# EAGLE design d_enc_v2 (EAGLE 7.2.0)
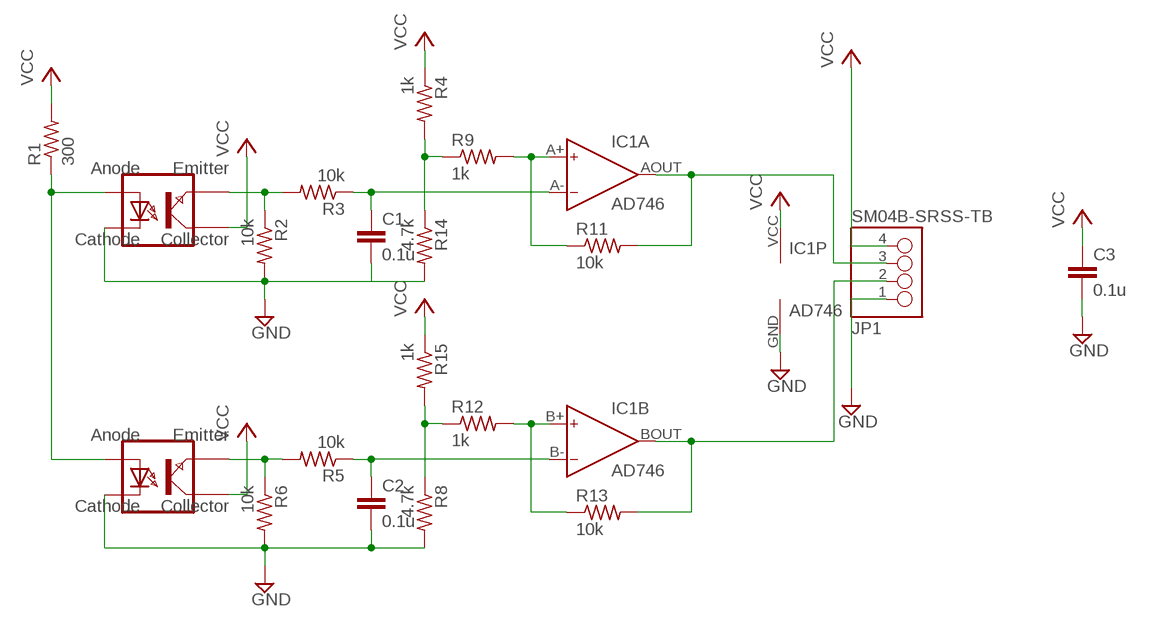
[diagram p0: schematic, sheet 1]

## Parts
C1  0.1u  C-EUC0603  [C0603]
C2  0.1u  C-EUC0603  [C0603]
C3  0.1u  C-EUC0603  [C0603]
IC1  AD746  [NJM2903E]
JP1  SM04B-SRSS-TB  [SM04B-SRSS-TB]
R1  300  R-US_R0603  [R0603]
R2  10k  R-US_R0603  [R0603]
R3  10k  R-US_R0603  [R0603]
R4  1k  R-US_R0603  [R0603]
R5  10k  R-US_R0603  [R0603]
R6  10k  R-US_R0603  [R0603]
R8  4.7k  R-US_R0603  [R0603]
R9  1k  R-US_R0603  [R0603]
R11  10k  R-US_R0603  [R0603]
R12  1k  R-US_R0603  [R0603]
R13  10k  R-US_R0603  [R0603]
R14  4.7k  R-US_R0603  [R0603]
R15  1k  R-US_R0603  [R0603]
U$1  TPR-105F  [TPR-105F]
U$4  TPR-105F  [TPR-105F]

## Nets
GND: C1.2 C2.2 C3.2 IC1.GND(P:V-) JP1.1 R2.2 R6.2 R8.2 R14.2 U$1.CATHODE U$4.CATHODE
N$1: C1.1 IC1.A-(A:IN-) R3.1
N$2: R1.1 U$1.ANODE U$4.ANODE
N$3: R2.1 R3.2 U$4.EMITTER
N$4: R5.2 R6.1 U$1.EMITTER
N$5: IC1.A+(A:IN+) R9.2 R11.1
N$6: C2.1 IC1.B-(B:IN-) R5.1
N$7: IC1.AOUT(A:OUT) JP1.3 R11.2
N$8: IC1.BOUT(B:OUT) JP1.2 R13.2
N$12: R8.1 R12.1 R15.2
N$13: IC1.B+(B:IN+) R12.2 R13.1
N$14: R4.2 R9.1 R14.1
VCC: C3.1 IC1.VCC(P:V+) JP1.4 R1.2 R4.1 R15.1 U$1.COLLECTOR U$4.COLLECTOR

## Library data of the parts
C1-C3 = rcl:C-EU: CAPACITOR, European symbol
IC1 = analog-devices:AD746: Dual Precision, 500 ns Settling, BiFET Op Amp Source: http://www.analog.com/static/imported-files/data_sheets/AD746.pdf
JP1 = con-jst-sh:SM04B-SRSS-TB
R1-R6 R8 R9 R11-R15 = rcl:R-US_: RESISTOR, American symbol
U$1 U$4 = lbr-127hld:TPR-105F

## Board
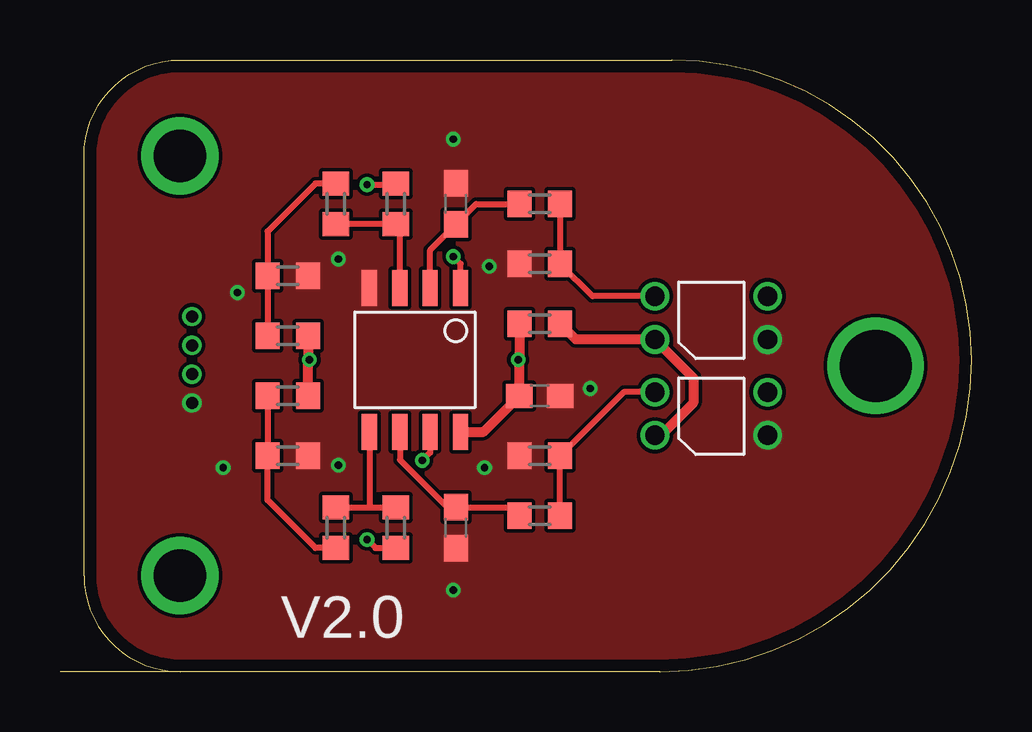
[diagram p1: board, top side]
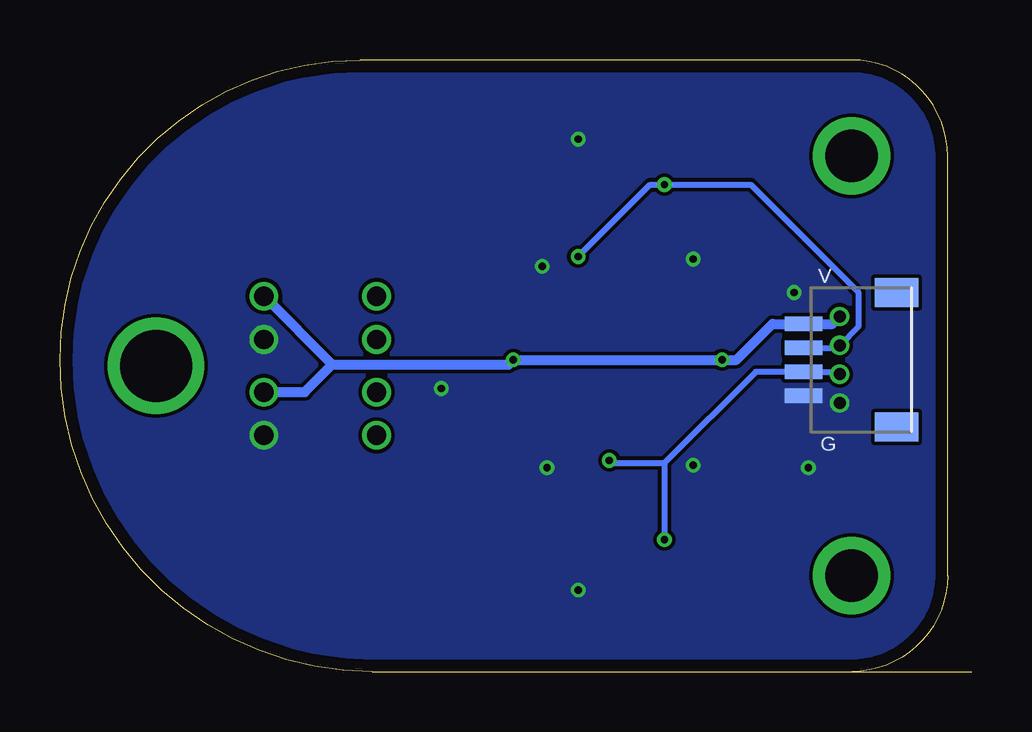
[diagram p2: board, bottom side, seen from below]

Size 38 x 25.5 mm. Coordinates in mm from the lower left corner, seen from the top.
Outline: 5,0 25,0 arc90 38,13 arc90 25.5,25.5 5,25.5 arc90 1,21.5 1,4 arc90 5,0
Outline: 5,0 0,0
Copper layers (1*16): Top 0.035mm / dielectric 1.6mm / Bottom 0.035mm
Design rules "Elecrow_2-layer_PCB_eagle_rule": minimum track width 6mil, minimum drill 12mil, track to track 6mil, track to pad 6mil, pad to pad 6mil, via to via 8mil, smd to smd 0mil, copper to edge 20mil, drill to drill 10mil, minimum pad ring 6mil, minimum via ring 6mil, stop-mask expansion 0mil, vias tented up to drill 100mil, thermal gap 10mil

### Footprints (pad centres in the part's own frame; a part is rotated, then mirrored left to right if it is on the bottom)
C0603 = smd 1.1 x 1: 1 -0.85,0; 2 0.85,0
NJM2903E = smd 1.5 x 0.635: A+ -3,-0.63; A- -3,0.63; AOUT -3,1.9; B+ 3,-1.9; B- 3,-0.63; BOUT 3,0.63; GND -3,-1.9; VCC 3,1.9
SM04B-SRSS-TB = smd 0.6 x 1.55: 1 -1.5,0; 2 -0.5,0; 3 0.5,0; 4 1.5,0 | smd 1.2 x 1.8: P-MOUNT1 -2.8,-3.875; P-MOUNT2 2.8,-3.875
R0603 = smd 1 x 1.1: 1 -0.85,0; 2 0.85,0
TPR-105F = drill 0.8: ANODE 3.7,2.4; CATHODE -1,2.4; COLLECTOR -1,0.6; EMITTER 3.7,0.6

### Placement (x,y rotation side)
C1  16.5,19.5 90 top
C2  16.5,6 270 top
C3  20,11.5 0 top
IC1  14.8,13 270 top
JP1  7,13 90 bottom
R1  20,14.5 180 top
R2  20,17 180 top
R3  20,19.5 0 top
R4  9.5,14 180 top
R5  20,6.5 0 top
R6  20,9 180 top
R8  9.5,9 0 top
R9  11.5,19.5 270 top
R11  14,19.5 90 top
R12  11.5,6 90 top
R13  14,6 270 top
R14  9.5,16.5 0 top
R15  9.5,11.5 180 top
U$1  28.5,12.25 180 top
U$4  28.5,16.25 180 top

### Tracks (layer width: path | path; a pad name or v marks a point on that pad's centre or on a via)
GND  (via drill 0.3, 0.5)
  other vias: 6.8,8.5 16.4,3.4 16.4,22.2 11.6,17.2 11.6,8.6 7.4,15.8 17.9,16.9 22.1,11.8 17.7,8.5 5.5,11.2
  pour Top (rank 6, no thermals): -19,40 51,40 51,-5 -19,-5
  pour Bottom (rank 6, no thermals): -14,35 46,35 46,-2 -14,-2
N$1
  Top 0.254: IC1.A- 15.43,17.58 C1.1 17.35,19.5 R3.1
N$2
  Top 0.406: U$1.ANODE 25.05,9.85 26.4,11.2 26.4,12.25 U$4.ANODE 21.5,13.85 R1.1
N$3
  Top 0.254: U$4.EMITTER 22.2,15.65 R2.1 R3.2
N$4
  Top 0.254: R5.2 R6.1 23.5,11.65 U$1.EMITTER
N$5
  Top 0.254: IC1.A+ 14.17,18.48 R11.1 R9.2
N$6
  Top 0.254: R5.1 18.8,6.85 C2.1 16.15,6.85 14.17,8.83 IC1.B-
N$7  (via drill 0.3, 0.5)
  Top 0.254: IC1.AOUT 16.7,17 v16.4,17.3 | v12.8,20.3 13.95,20.3 R11.2
  Bottom 0.254: v16.4,17.3 13.4,20.3 v12.8,20.3 9.2,20.3 4.7,15.8 4.7,14.4 v5.5,13.6 5.6,13.5 JP1.3
N$8  (via drill 0.3, 0.5)
  Top 0.254: v12.8,5.5 13.15,5.15 R13.2 | IC1.BOUT 15.43,9.13 v15.1,8.8
  Bottom 0.254: 12.8,8.7 9,12.5 JP1.2 5.6,12.5 v5.5,12.4 | 12.8,8.7 v12.8,5.5 | v15.1,8.8 15,8.7 12.8,8.7
N$9  (via drill 2.2)
  other vias: 5,21.5
N$10  (via drill 2.2)
  other vias: 5,4
N$11  (via drill 3)
  other vias: 34,12.75
N$12
  Top 0.254: R15.2 R8.1 8.65,7.15 10.65,5.15 R12.1
N$13
  Top 0.254: R12.2 12.9,6.85 | 12.9,6.85 R13.1 | IC1.B+ 12.9,6.85
N$14
  Top 0.254: R9.1 10.65,20.35 8.65,18.35 R14.1 R4.2
VCC  (via drill 0.3, 0.5)
  Top 0.406: R1.2 19.15,13.05 v19.1,13 19.15,12.95 C3.1 17.65,10 IC1.VCC | R4.1 10.35,13.05 v10.4,13 10.35,12.95 R15.1
  Bottom 0.406: U$4.COLLECTOR 26.65,12.8 | 26.65,12.8 19.3,12.8 v19.1,13 v10.4,13 9.8,13 8.3,14.5 JP1.4 5.8,14.5 v5.5,14.8 | U$1.COLLECTOR 27.8,11.65 26.65,12.8

### Text on the board
tNames: V2.0
bNames: V | G
Measures: 37mm | 33.0mm | 4.0mm | φ2.2mm | φ3.0mm | 25.5mm | 21.5mm | 12.75mm | 4.0mm